# Altium project Анализатор .034 -лист 1.PrjPcb
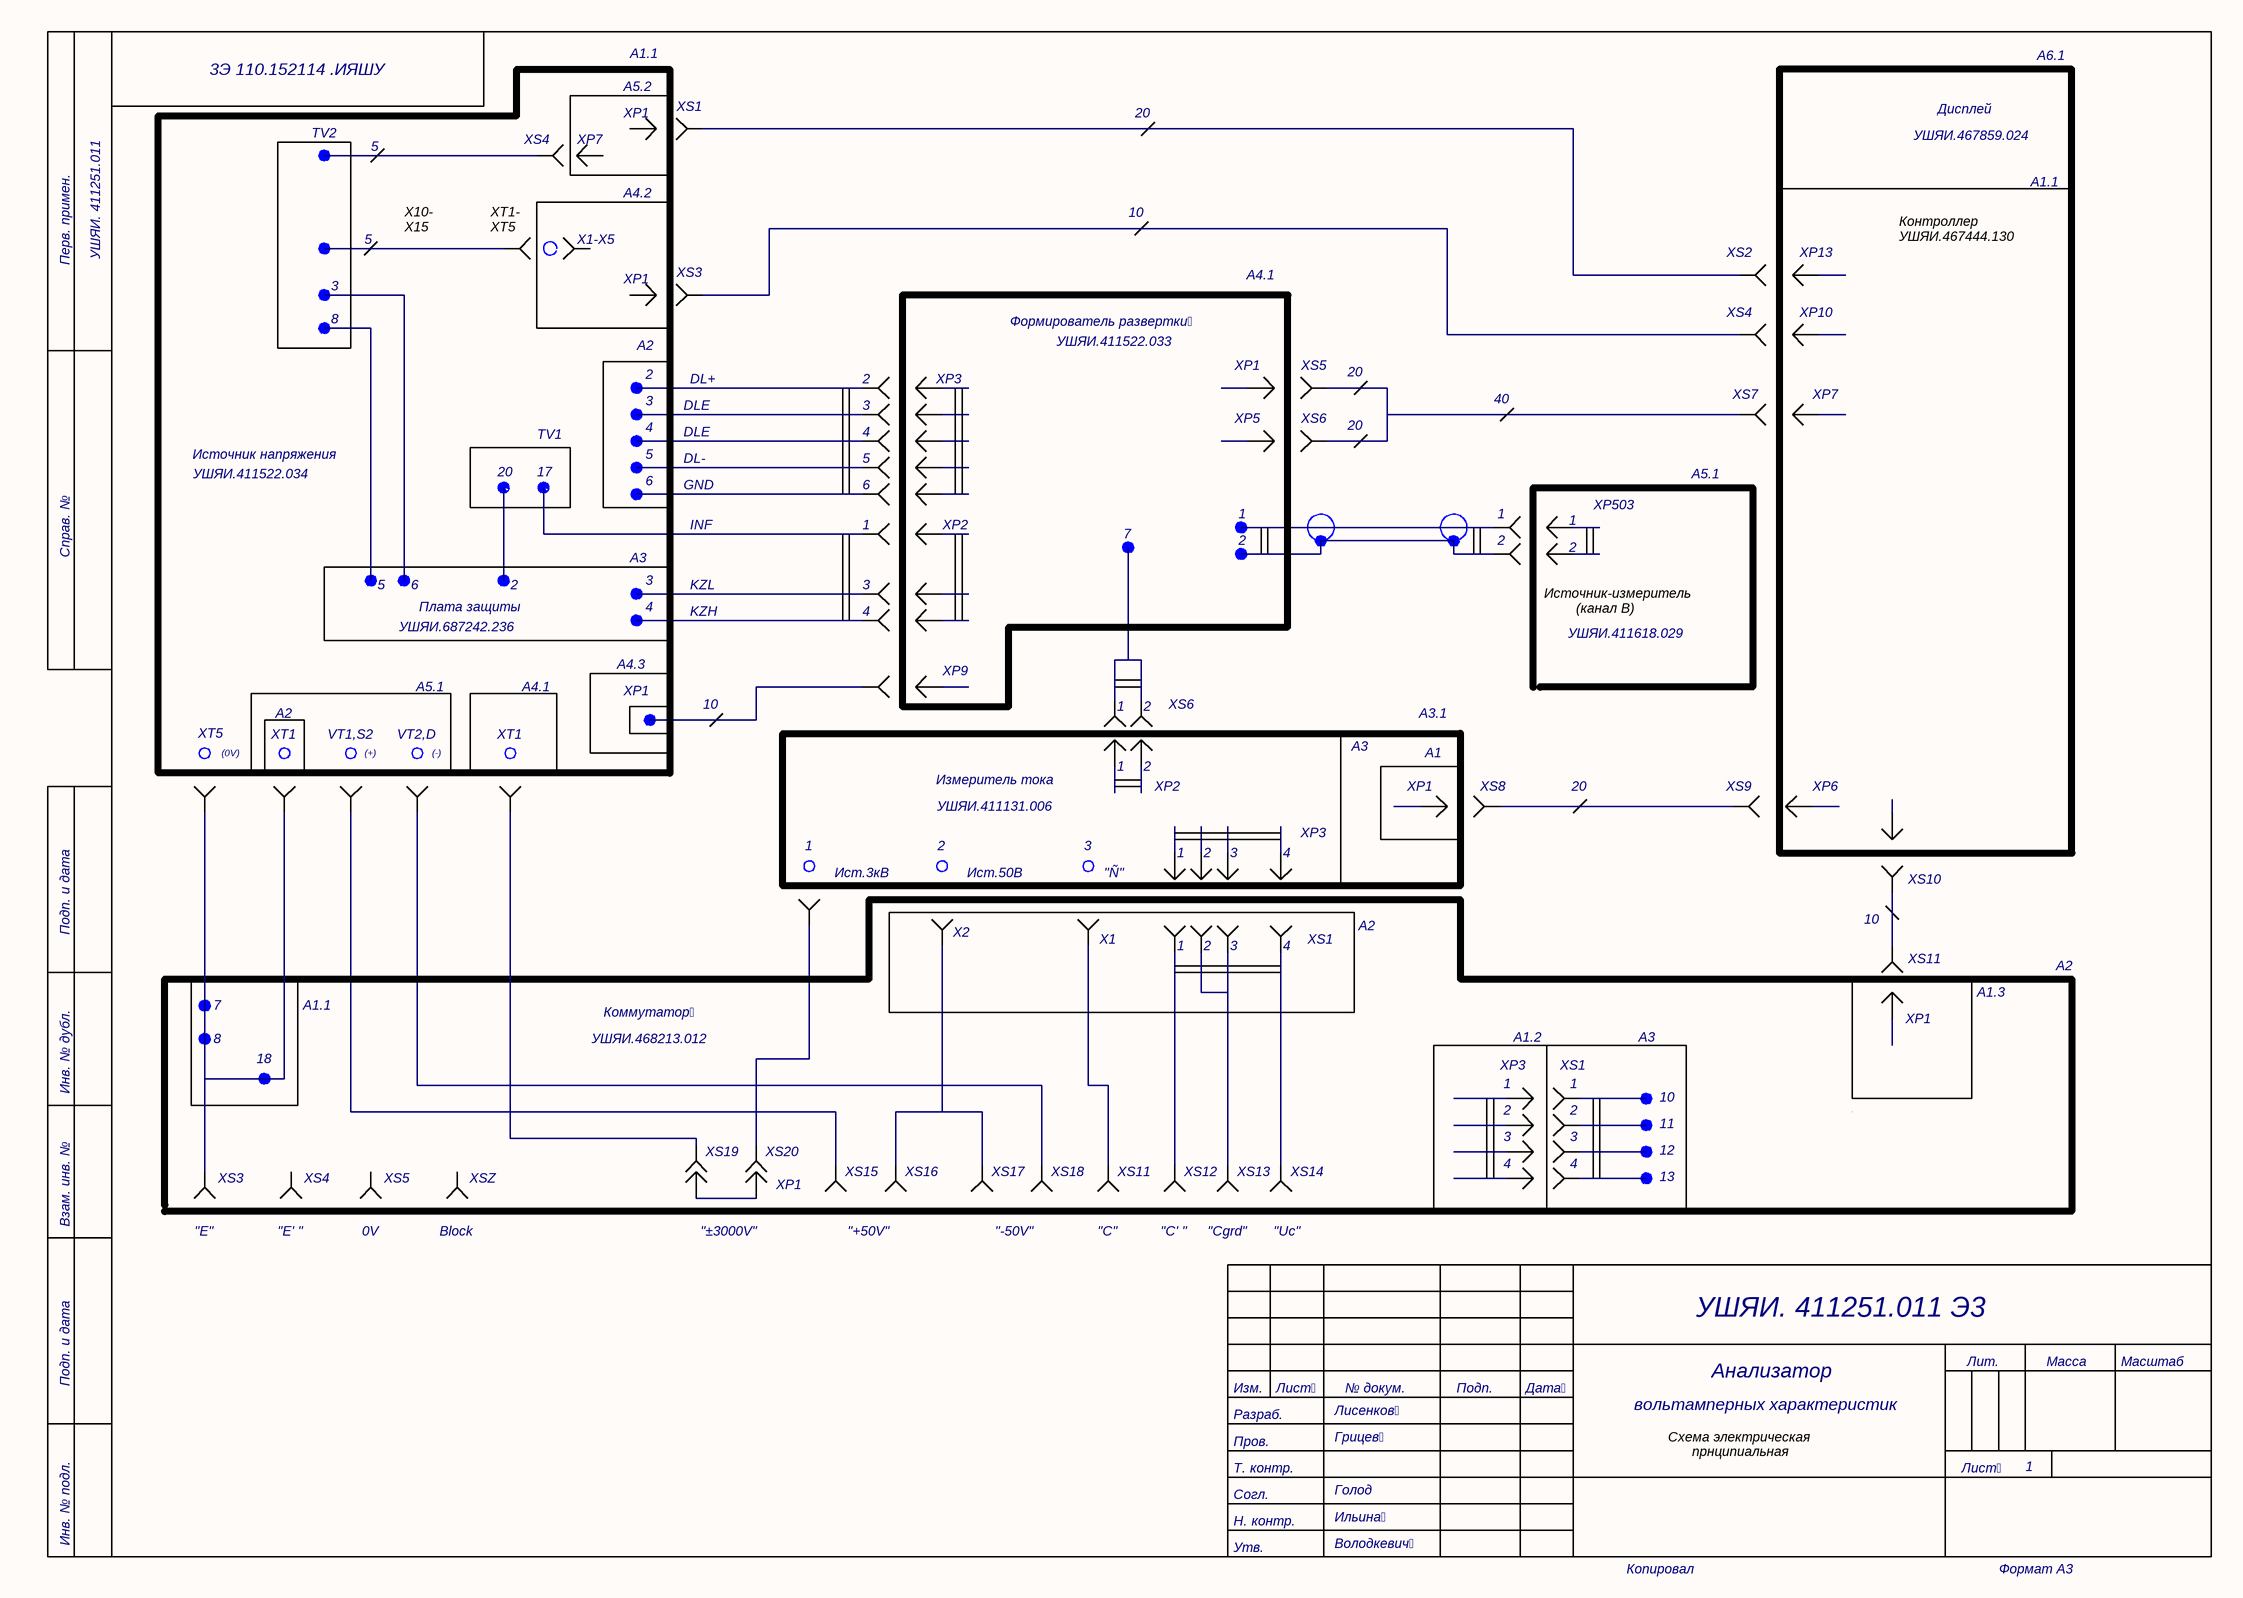
[diagram p0: Sheet1.SCHDOC]
1 sheet, 92 parts. Net scope: global (net labels, ports and power ports of the same name join across sheets).

## Sheet Sheet1.SCHDOC
size 420 x 297 mm; SheetNumber: 1; SheetTotal: 1; DocumentName: Sheet1.SCHDOC

### Parts
U2  PLUG  (value not drawn)
U3  PLUG  (value not drawn)
U4  PLUG  (value not drawn)
U5  PLUG  (value not drawn)
U6  PLUG  (value not drawn)
U7  PLUG  (value not drawn)
U8  SOCKET  (value not drawn)
U9  SOCKET  (value not drawn)
U10  PLUG  (value not drawn)
U11  SOCKET  (value not drawn)
U12  SOCKET  (value not drawn)
U13  SOCKET  (value not drawn)
U14  SOCKET  (value not drawn)
U15  SOCKET  (value not drawn)
U16  PLUG  (value not drawn)
U17  SOCKET  (value not drawn)
U18  PLUG  (value not drawn)
U19  PLUG  (value not drawn)
U20  PLUG  (value not drawn)
U21  PLUG  (value not drawn)
U22  PLUG  (value not drawn)
U23  PLUG  (value not drawn)
U24  PLUG  (value not drawn)
U25  SOCKET  (value not drawn)
U26  SOCKET  (value not drawn)
U27  SOCKET  (value not drawn)
U28  SOCKET  (value not drawn)
U29  SOCKET  (value not drawn)
U30  PLUG  (value not drawn)
U31  PLUG  (value not drawn)
U33  PLUG  (value not drawn)
U34  SOCKET  (value not drawn)
U35  PLUG  (value not drawn)
U36  PLUG  (value not drawn)
U37  PLUG  (value not drawn)
U38  PLUG  (value not drawn)
U39  PLUG  (value not drawn)
U40  PLUG  (value not drawn)
U41  PLUG  (value not drawn)
U61  SOCKET  (value not drawn)
U63  PLUG  (value not drawn)
U65  SOCKET  (value not drawn)
U67  SOCKET  (value not drawn)
U72  SOCKET  (value not drawn)
U78  SOCKET  (value not drawn)
U79  SOCKET  (value not drawn)
U83  SOCKET  (value not drawn)
U86  SOCKET  (value not drawn)
U87  SOCKET  (value not drawn)
U88  SOCKET  (value not drawn)
U89  SOCKET  (value not drawn)
U90  PLUG  (value not drawn)
U91  PLUG  (value not drawn)
U92  PLUG  (value not drawn)
U93  SOCKET  (value not drawn)
U94  SOCKET  (value not drawn)
U95  SOCKET  (value not drawn)
U96  PLUG  (value not drawn)
U97  SOCKET  (value not drawn)
U99  PLUG  (value not drawn)
U100  SOCKET  (value not drawn)
U101  SOCKET  (value not drawn)
U102  PLUG  (value not drawn)
U103  SOCKET  (value not drawn)
U104  PLUG  (value not drawn)
U105  SOCKET  (value not drawn)
U106  SOCKET  (value not drawn)
U108  SOCKET  (value not drawn)
U109  SOCKET  (value not drawn)
U110  SOCKET  (value not drawn)
U114  SOCKET  (value not drawn)
U115  SOCKET  (value not drawn)
U116  SOCKET  (value not drawn)
U117  SOCKET  (value not drawn)
U118  PLUG  (value not drawn)
U119  SOCKET  (value not drawn)
U120  PLUG  (value not drawn)
U121  SOCKET  (value not drawn)
XS1  SOCKET  (value not drawn)
XS2  SOCKET  (value not drawn)
XS3  SOCKET  (value not drawn)
XS4  SOCKET  (value not drawn)
XS5  SOCKET  (value not drawn)
XS6  SOCKET  (value not drawn)
XS7  SOCKET  (value not drawn)
XS8  SOCKET  (value not drawn)
XS9  SOCKET  (value not drawn)
XS11  SOCKET  (value not drawn)
XS12  SOCKET  (value not drawn)
XS13  SOCKET  (value not drawn)
XS14  SOCKET  (value not drawn)
XS15  SOCKET  (value not drawn)

### Blocks framed on the sheet
3Э 110.152114 .ИЯШУ: U16 U33 U40 XS9 XS11 XS12

### Nets
NetU8_1: U8.1 U9.1
NetU25_1: U25.1 U67.1
NetU26_1: U26.1 U27.1 U72.1
NetU28_1: U28.1 U79.1
NetU29_1: U29.1 U65.1
NetU78_1: U78.1 U115.1
NetU83_1: U83.1 U109.1
NetU87_1: U87.1 U88.1 U110.1
NetU89_1: U89.1 U108.1
NetU91_1: U91.1 U92.1
NetU94_1: U94.1 U114.1
NetU100_1: U100.1 U105.1 U106.1
NetXS1_1: XS1.1 XS2.1
NetXS3_1: XS3.1 XS4.1 XS14.1
NetXS5_1: XS5.1 XS6.1
NetXS7_1: XS7.1 XS8.1
NetXS13_1: XS13.1 XS15.1

Not connected (* = marked no-connect by the designer): U2 1; U3 1; U4 1; U5 1; U6 1; U7 1; U10 1; U11 1; U12 1; U13 1; U14 1; U15 1; U16 1; U17 1; U18 1; U19 1; U20 1; U21 1; U22 1; U23 1; U24 1; U30 1; U31 1; U33 1; U34 1; U35 1; U36 1; U37 1; U38 1; U39 1; U40 1; U41 1; U61 1; U63 1; U86 1; U90 1; U93 1; U95 1; U96 1; U97 1; U99 1; U101 1; U102 1; U103 1; U104 1; U116 1; U117 1; U118 1; U119 1; U120 1; U121 1; XS9 1; XS11 1; XS12 1

### Notes on the sheet
- A1.1
- A6.1
- (near U16) XP1
- A5.2
- (near XS1) XS1
- 20
- Дисплей
- УШЯИ. 411251.011
- TV2
- 5
- (near XS11) XS4
- (near U33) XP7
- УШЯИ.467859.024
- Перв. примен.
- X10-
  X15
- (near XS9) XT1-
  ХТ5
- (near XS12) X1-Х5
- A4.2
- 10
- (near XS2) XS2
- (near U37) XP13
- Контроллер
  УШЯИ.467444.130
- 3
- 8
- (near U40) XP1
- (near XS13) XS3
- Формирователь развертки
- A4.1
- (near XS15) XS4
- (near U41) XP10
- A2
- 2
- DL+
- (near U11) 2
- (near U2) XP3
- УШЯИ.411522.033
- (near U7) XP1
- (near XS3) XS5
- (near XS3) 20
- (near XS4) XS7
- (near U36) XP7
- Источник напряжения
- TV1
- 4
- DLE
- DL-
- XP5
- (near XS14) XS6
- 40
- УШЯИ.411522.034
- 17
- 6
- GND
- INF
- (near U103) 1
- (near U102) XP2
- 7
- 1
- (near U34) 1
- (near U31) 1
- XP503
- A5.1
- Справ. №
- A3
- KZL
- (near U61) 3
- УШЯИ.687242.236
- Плата защиты
- KZH
- Источник-измеритель
  (канал В)
- УШЯИ.411618.029
- ХТ5
- ХТ1
- VT1,S2
- VT2,D
- XT1
- A4.3
- XP1
- (near U120) XP9
- (near U9) 1
- (near U8) 2
- (near U8) XS6
- A3.1
- (0V)
- (+)
- (near U115) (-)
- Измеритель тока
- УШЯИ.411131.006
- (near U18) 1
- (near U19) 2
- XP2
- (near U24) XP1
- A1
- (near XS5) XS8
- (near XS6) XS9
- (near U35) XP6
- (near U109) Ист.3кВ
- Ист.50В
- "Ñ"
- (near U22) 1
- (near U23) 2
- (near U20) 3
- (near U21) 4
- (near U21) XP3
- Подп. и дата
- (near U110) X2
- (near U29) X1
- (near U28) XS1
- (near XS7) XS10
- (near U25) 1
- (near U26) 2
- (near U27) 3
- (near U28) 4
- (near XS8) XS11
- А1.3
- 18
- УШЯИ.468213.012
- Коммутатор
- (near U96) XP3
- А1.2
- (near U116) XS1
- А3
- (near U39) XP1
- Инв. № дубл.
- (near U96) 1
- (near U116) 1
- 11
- (near U100) XS3
- (near U97) XS4
- (near U86) XS5
- (near U93) XSZ
- XS19
- (near U83) XS20
- XS15
- (near U87) XS16
- XS17
- (near U78) XS18
- (near U65) XS11
- XS12
- XS13
- (near U79) XS14
- 12
- 13
- Взам. инв. №
- (near U100) "E"
- (near U97) "E' "
- (near U86) 0V
- (near U93) Block
- "±3000V"
- "+50V"
- "-50V"
- (near U65) "C"
- "C' "
- "Cgrd"
- "Uc"
- УШЯИ. 411251.011 Э3
- Изм.
- Лист
- Лисенков
- № докум.
- Подп.
- Дата
- вольтамперных характеристик
- Анализатор
- Лит.
- Масса
- Масштаб
- Пров.
- Т. контр.
- Разраб.
- Грицев
- Схема электрическая
  прнципиальная
- Инв. № подл.
- Н. контр.
- Согл.
- Ильина
- Голод
- Володкевич
- Утв.
- Копировал
- Формат А3

### Library data of the parts
U2-U7 U10 U16 U18-U24 U30 U31 U33 U35-U41 U63 U90-U92 U96 U99 U102 U104 U118 U120 = PLUG: Value: *
U8 U9 U11-U15 U17 U25-U29 U34 U61 U65 U67 U72 U78 U79 U83 U86-U89 U93-U95 U97 U100 U101 U103 U105 U106 U108-U110 U114-U117 U119 U121 XS1-XS9 XS11-XS15 = SOCKET: Value: *